# EAGLE schematic remote_25_45_85-1wire (EAGLE 7.6.0)
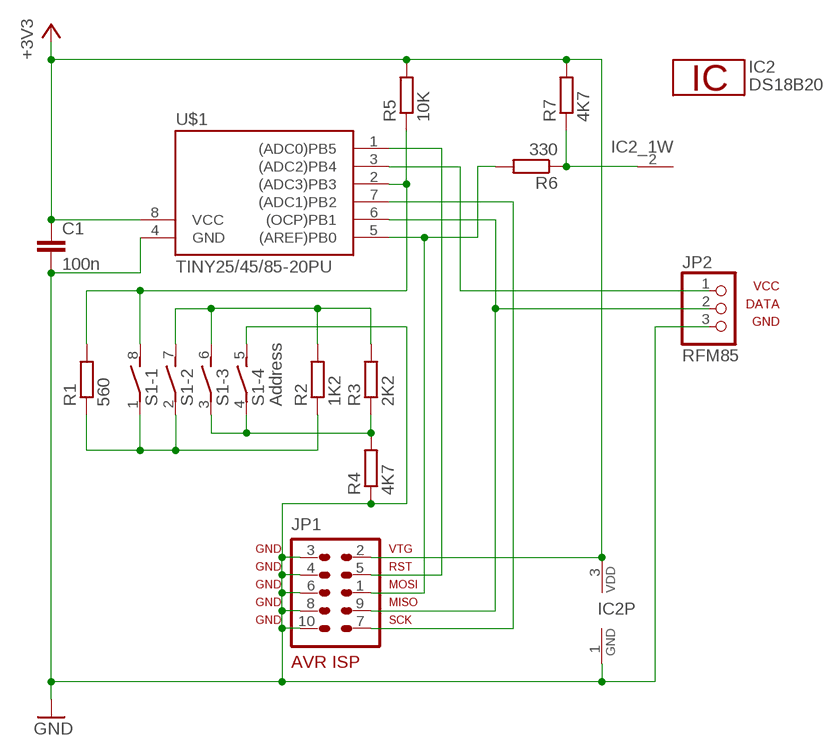
[diagram p0: schematic, sheet 1]

## Parts
C1  100n  C-EU025-025X050  [C025-025X050]
IC2  DS18B20  [TO92-]
JP1  AVR-ISP-10  [AVR-ISP-10]
JP2  RFM85  PINHD-1X3  [1X03]
R1  560  R-EU_0204/7  [0204/7]
R2  1K2  R-EU_0204/7  [0204/7]
R3  2K2  R-EU_0204/7  [0204/7]
R4  4K7  R-EU_0204/7  [0204/7]
R5  10K  R-EU_0204/7  [0204/7]
R6  330  R-EU_0204/7  [0204/7]
R7  4K7  R-EU_0204/7  [0204/7]
S1  Address  DIP04S  [DIP04S]
U$1  TINY25/45/85-20PU  TINY25/45/85-20SU  [SOIC8]

## Nets
+3V3: C1.1 IC2.3 JP1.2 R5.2 R7.2 U$1.8(VCC)
GND: C1.2 IC2.1 JP1.3 JP1.4 JP1.6 JP1.8 JP1.10 JP2.3 R4.1 S1.5 U$1.4(GND)
N$1: JP1.1 U$1.5((AREF)PB0)
N$2: JP1.7 U$1.7((ADC1)PB2)
N$3: JP1.9 JP2.2 U$1.6((OCP)PB1)
N$4: R6.2
N$5: R1.1 R2.1 S1.1 S1.2
N$6: JP2.1 U$1.3((ADC2)PB4)
N$7: JP1.5 U$1.1((ADC0)PB5)
N$8: R1.2 R5.1 S1.8 U$1.2((ADC3)PB3)
N$9: R2.2 R3.2 S1.6 S1.7
N$10: R3.1 R4.2 S1.3 S1.4
N$14: IC2.2 R6.1 R7.1

## Notes on the sheet
- VCC
  DATA
  GND

## Library data of the parts
C1 = resistor:C-EU: CAPACITOR, European symbol
IC2 = 1wire:DS18B20: Programmable Resolution Digital Thermometer This chip provides a onewire thermosensor with approx. 0.5°C accuracy. A programmable over/undertemperure alarm is available. The precision can be set from 9..12 bits. Notes: Vdd must be applied for accurate measurements at low temperatures, as the parasite power circuit otherwise heats the sensor. If parasite power is used, Vdd has to be connected to GND. The DS1822 is a low-cost thermometer chip, the DS18S20 is similar to the DS18B20, but with 9 Bit precision only. Author: Jan Kandziora <jjj@gmx.de>
JP1 = avr-7:AVR-ISP-10: AVR ISP-10 Serial Programming Header
JP2 = pinhead:PINHD-1X3: PIN HEADER
R1-R7 = resistor:R-EU_: RESISTOR, European symbol
S1 = switch-dil:DIP04S: DIL/CODE SWITCH; OC_FARNELL: unknown; OC_NEWARK: unknown
U$1 = avr-7:TINY25/45/85